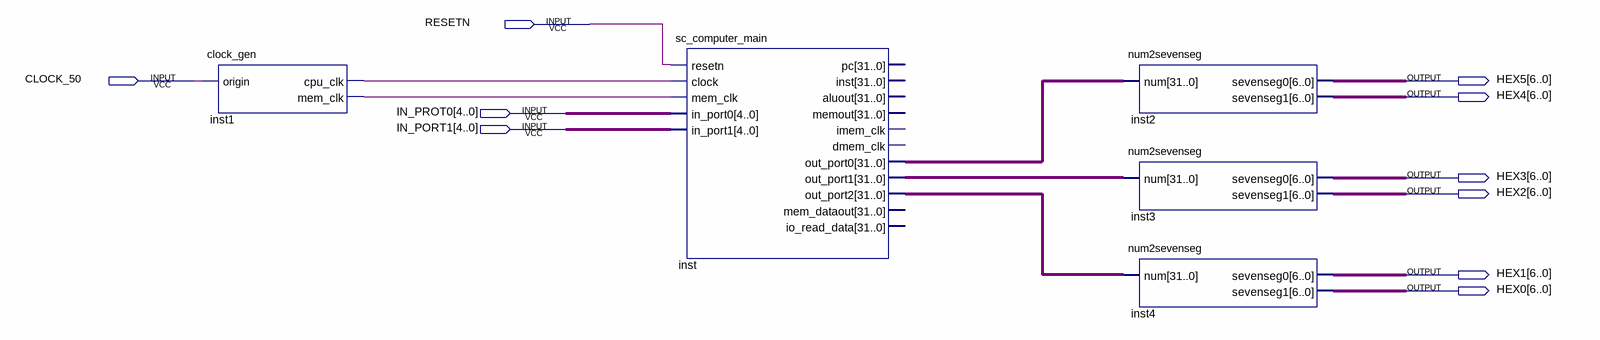
[diagram p0: schematic sheet]
// Quartus schematic sc_computer.bdf as structural Verilog: 5 symbols, 10 pins
module sc_computer (
  input  RESETN,
  input  CLOCK_50,
  input  [4:0] IN_PROT0,
  input  [4:0] IN_PORT1,
  output [6:0] HEX5,
  output [6:0] HEX4,
  output [6:0] HEX3,
  output [6:0] HEX2,
  output [6:0] HEX1,
  output [6:0] HEX0
);

  wire inst1_cpu_clk, inst1_mem_clk;
  wire [31:0] inst_out_port0, inst_out_port1, inst_out_port2;

  clock_gen inst1 (.origin(CLOCK_50), .cpu_clk(inst1_cpu_clk), .mem_clk(inst1_mem_clk));
  sc_computer_main inst (
    .resetn(RESETN), .clock(inst1_cpu_clk), .mem_clk(inst1_mem_clk), .in_port0(IN_PROT0),
    .in_port1(IN_PORT1), .out_port0(inst_out_port0), .out_port1(inst_out_port1), .out_port2(inst_out_port2));  // open: pc, inst, aluout, memout, imem_clk, dmem_clk, mem_dataout, io_read_data
  num2sevenseg inst2 (.num(inst_out_port0), .sevenseg0(HEX5), .sevenseg1(HEX4));
  num2sevenseg inst3 (.num(inst_out_port1), .sevenseg0(HEX3), .sevenseg1(HEX2));
  num2sevenseg inst4 (.num(inst_out_port2), .sevenseg0(HEX1), .sevenseg1(HEX0));
endmodule
